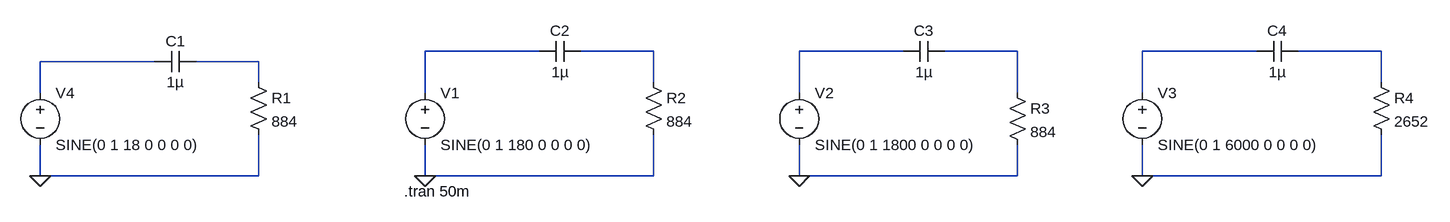
[diagram p0: schematic passaalta.asc]
passaalta.asc, the LTspice schematic file:
Version 4
SHEET 1 1540 680
WIRE 160 80 -16 80
WIRE 336 80 224 80
WIRE 720 80 560 80
WIRE 896 80 784 80
WIRE 1264 80 1088 80
WIRE 1456 80 1328 80
WIRE -432 96 -608 96
WIRE -272 96 -368 96
WIRE -272 128 -272 96
WIRE 336 128 336 80
WIRE 1456 128 1456 80
WIRE -608 144 -608 96
WIRE -16 144 -16 80
WIRE 560 144 560 80
WIRE 896 144 896 80
WIRE 1088 144 1088 80
WIRE -608 272 -608 224
WIRE -272 272 -272 208
WIRE -272 272 -608 272
WIRE -16 272 -16 224
WIRE 336 272 336 208
WIRE 336 272 -16 272
WIRE 560 272 560 224
WIRE 896 272 896 224
WIRE 896 272 560 272
WIRE 1088 272 1088 224
WIRE 1456 272 1456 208
WIRE 1456 272 1088 272
FLAG -16 272 0
FLAG 560 272 0
FLAG 1088 272 0
FLAG -608 272 0
SYMBOL voltage -16 128 R0
SYMATTR InstName V1
SYMATTR Value SINE(0 1 180 0 0 0 0)
SYMBOL voltage 560 128 R0
WINDOW 123 0 0 Left 0
WINDOW 39 0 0 Left 0
SYMATTR InstName V2
SYMATTR Value SINE(0 1 1800 0 0 0 0)
SYMBOL voltage 1088 128 R0
WINDOW 123 0 0 Left 0
WINDOW 39 0 0 Left 0
SYMATTR InstName V3
SYMATTR Value SINE(0 1 6000 0 0 0 0)
SYMBOL voltage -608 128 R0
WINDOW 123 0 0 Left 0
WINDOW 39 0 0 Left 0
SYMATTR InstName V4
SYMATTR Value SINE(0 1 18 0 0 0 0)
SYMBOL res -288 112 R0
SYMATTR InstName R1
SYMATTR Value 884
SYMBOL res 320 112 R0
SYMATTR InstName R2
SYMATTR Value 884
SYMBOL res 880 128 R0
SYMATTR InstName R3
SYMATTR Value 884
SYMBOL res 1440 112 R0
SYMATTR InstName R4
SYMATTR Value 2652
SYMBOL cap -368 80 R90
WINDOW 0 0 32 VBottom 2
WINDOW 3 32 32 VTop 2
SYMATTR InstName C1
SYMATTR Value 1µ
SYMBOL cap 224 64 R90
WINDOW 0 0 32 VBottom 2
WINDOW 3 32 32 VTop 2
SYMATTR InstName C2
SYMATTR Value 1µ
SYMBOL cap 784 64 R90
WINDOW 0 0 32 VBottom 2
WINDOW 3 32 32 VTop 2
SYMATTR InstName C3
SYMATTR Value 1µ
SYMBOL cap 1328 64 R90
WINDOW 0 0 32 VBottom 2
WINDOW 3 32 32 VTop 2
SYMATTR InstName C4
SYMATTR Value 1µ
TEXT -48 296 Left 2 !.tran 50m

The netlist it stands for:
* passaalta.asc
V1 N001 0 SINE(0 1 180 0 0 0 0)
V2 N003 0 SINE(0 1 1800 0 0 0 0)
V3 N005 0 SINE(0 1 6000 0 0 0 0)
V4 N007 0 SINE(0 1 18 0 0 0 0)
R1 N008 0 884
R2 N002 0 884
R3 N004 0 884
R4 N006 0 2652
C1 N008 N007 1µ
C2 N002 N001 1µ
C3 N004 N003 1µ
C4 N006 N005 1µ
.tran 50m
.backanno
.end